# EasyEDA Pro project 红外ver2.0.eprj

# Schematic Schematic1

## Sheets
1 Source: Board Name: Board1; Create Date: 2025-09-16; Page Name: Source; Project Name: 红外ver2.0; Schematic Name: Schematic1; Update Date: 2025-09-17; Company: 嘉立创EDA; Drawed: lilinng; Page Size: A4; Version: V2.0
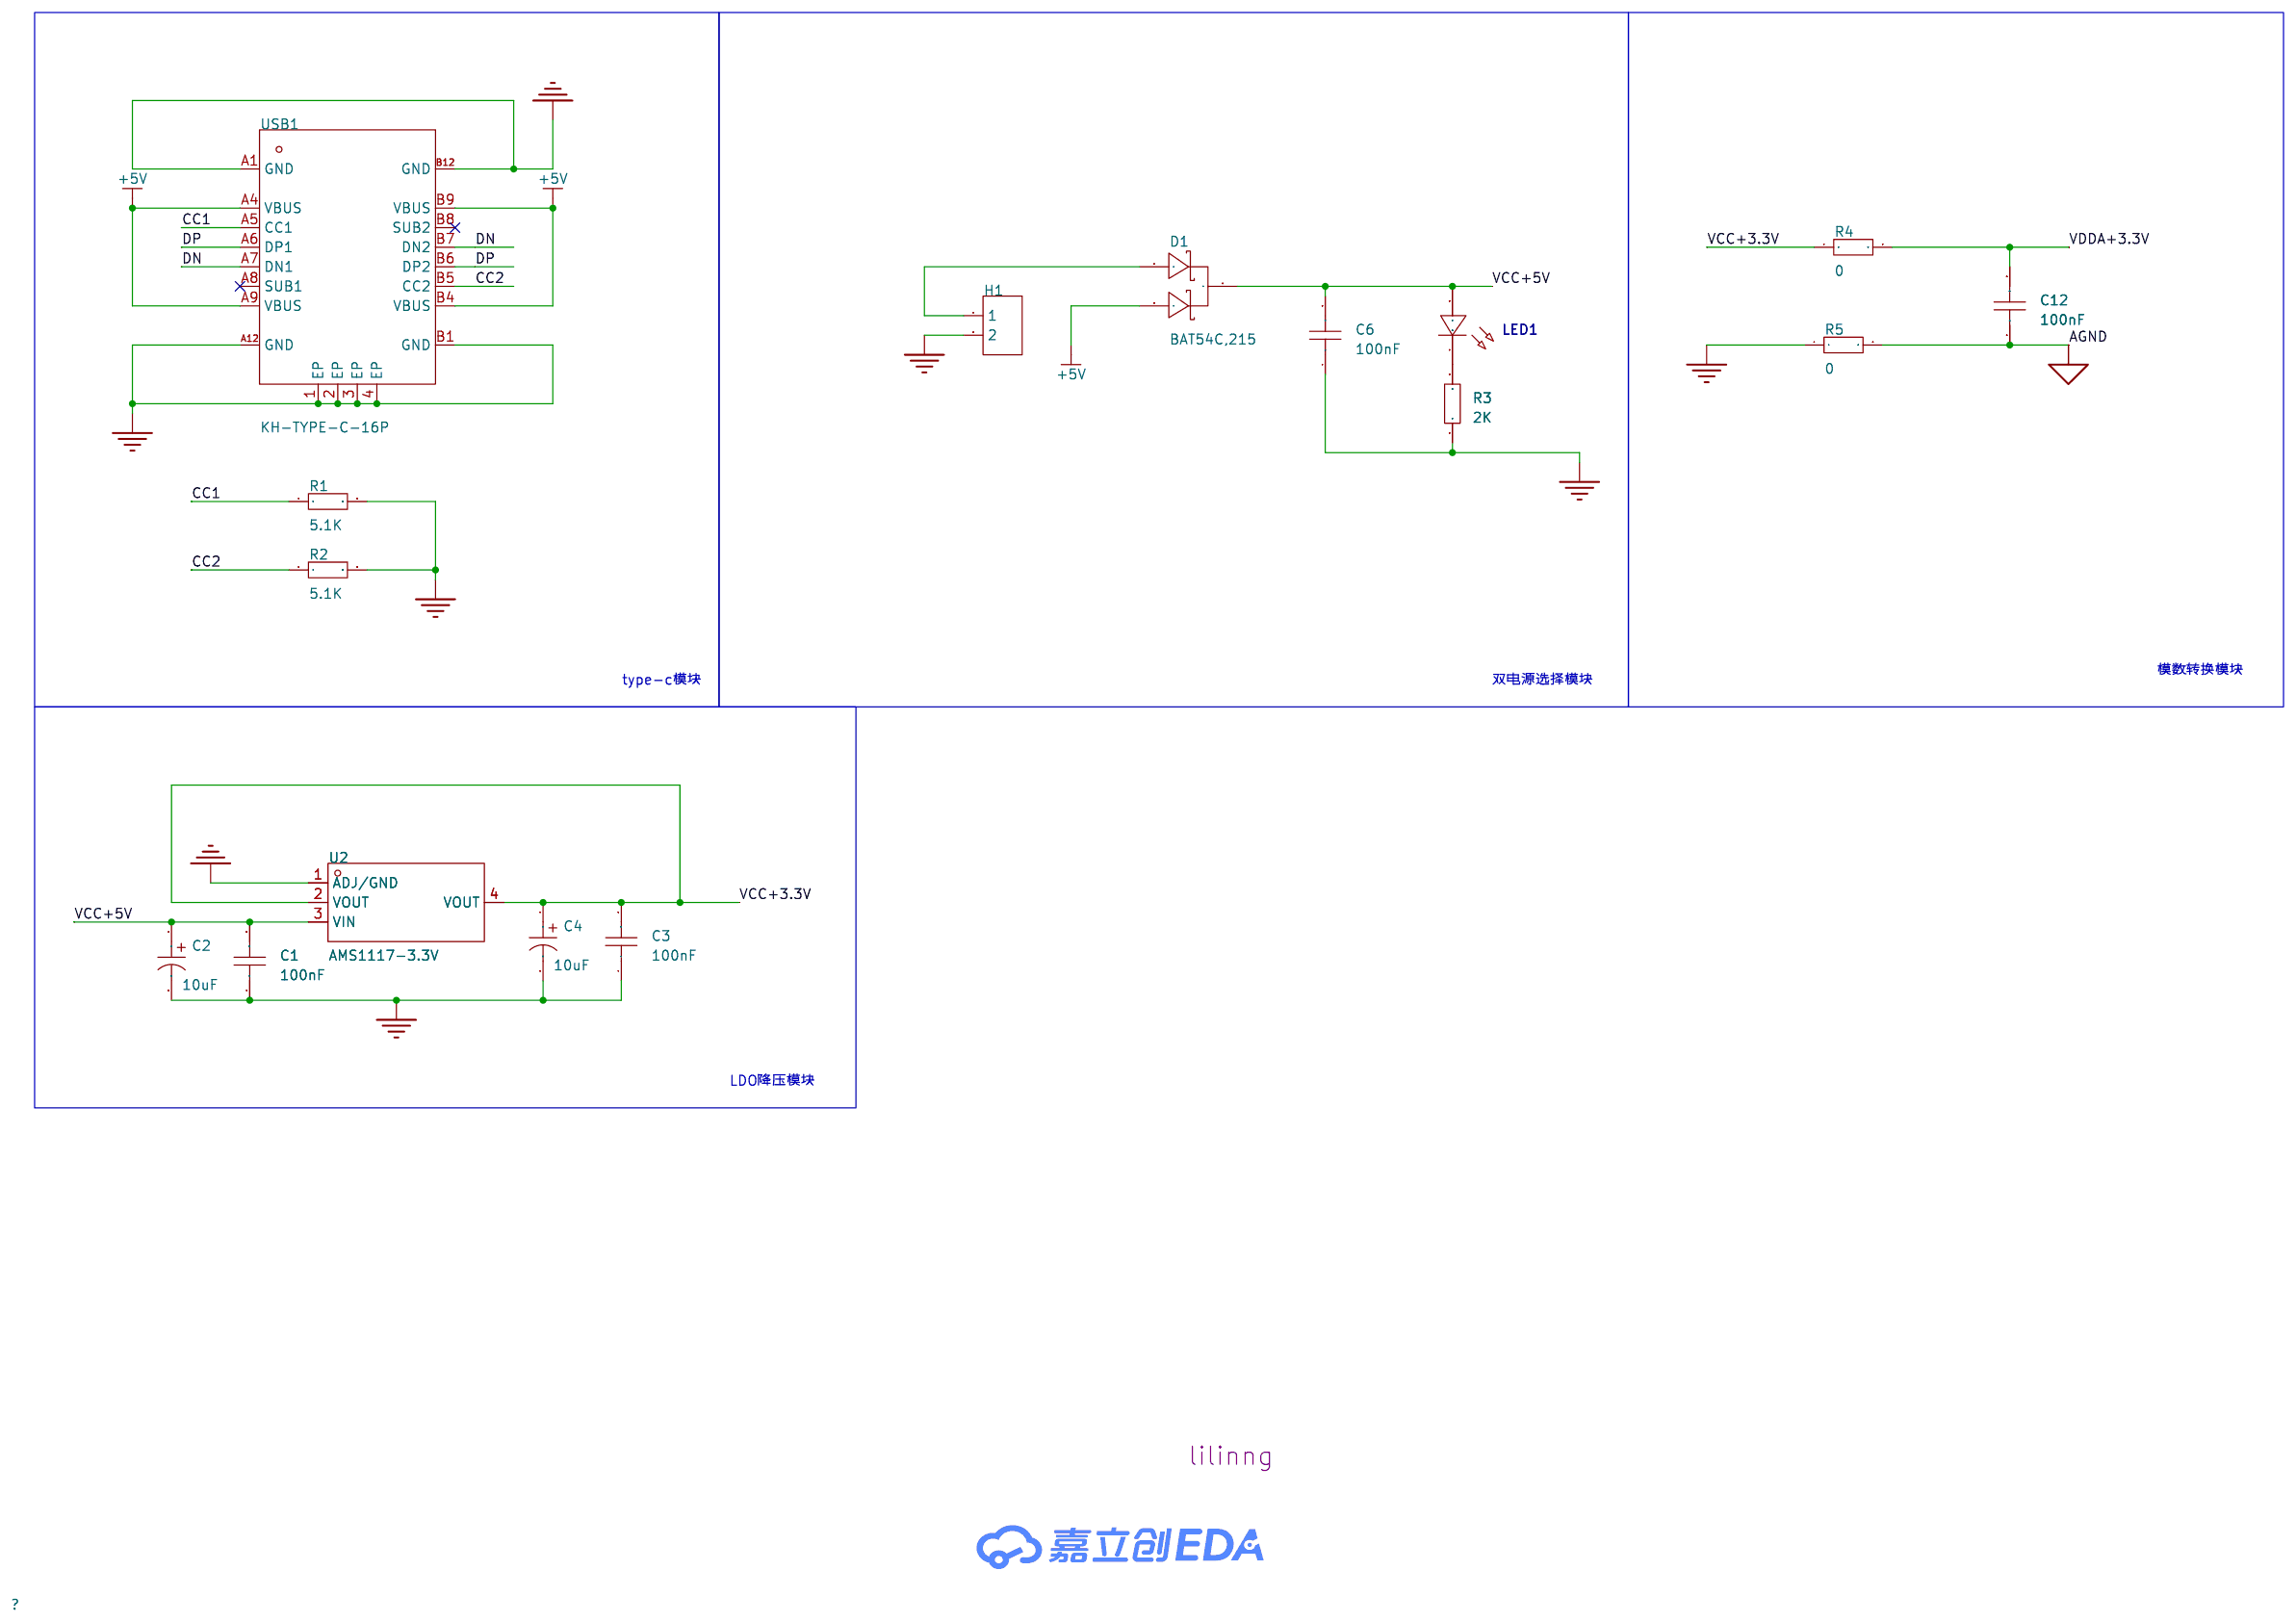
[diagram p0: Source]
2 System: Page Name: System; Version: V1.0
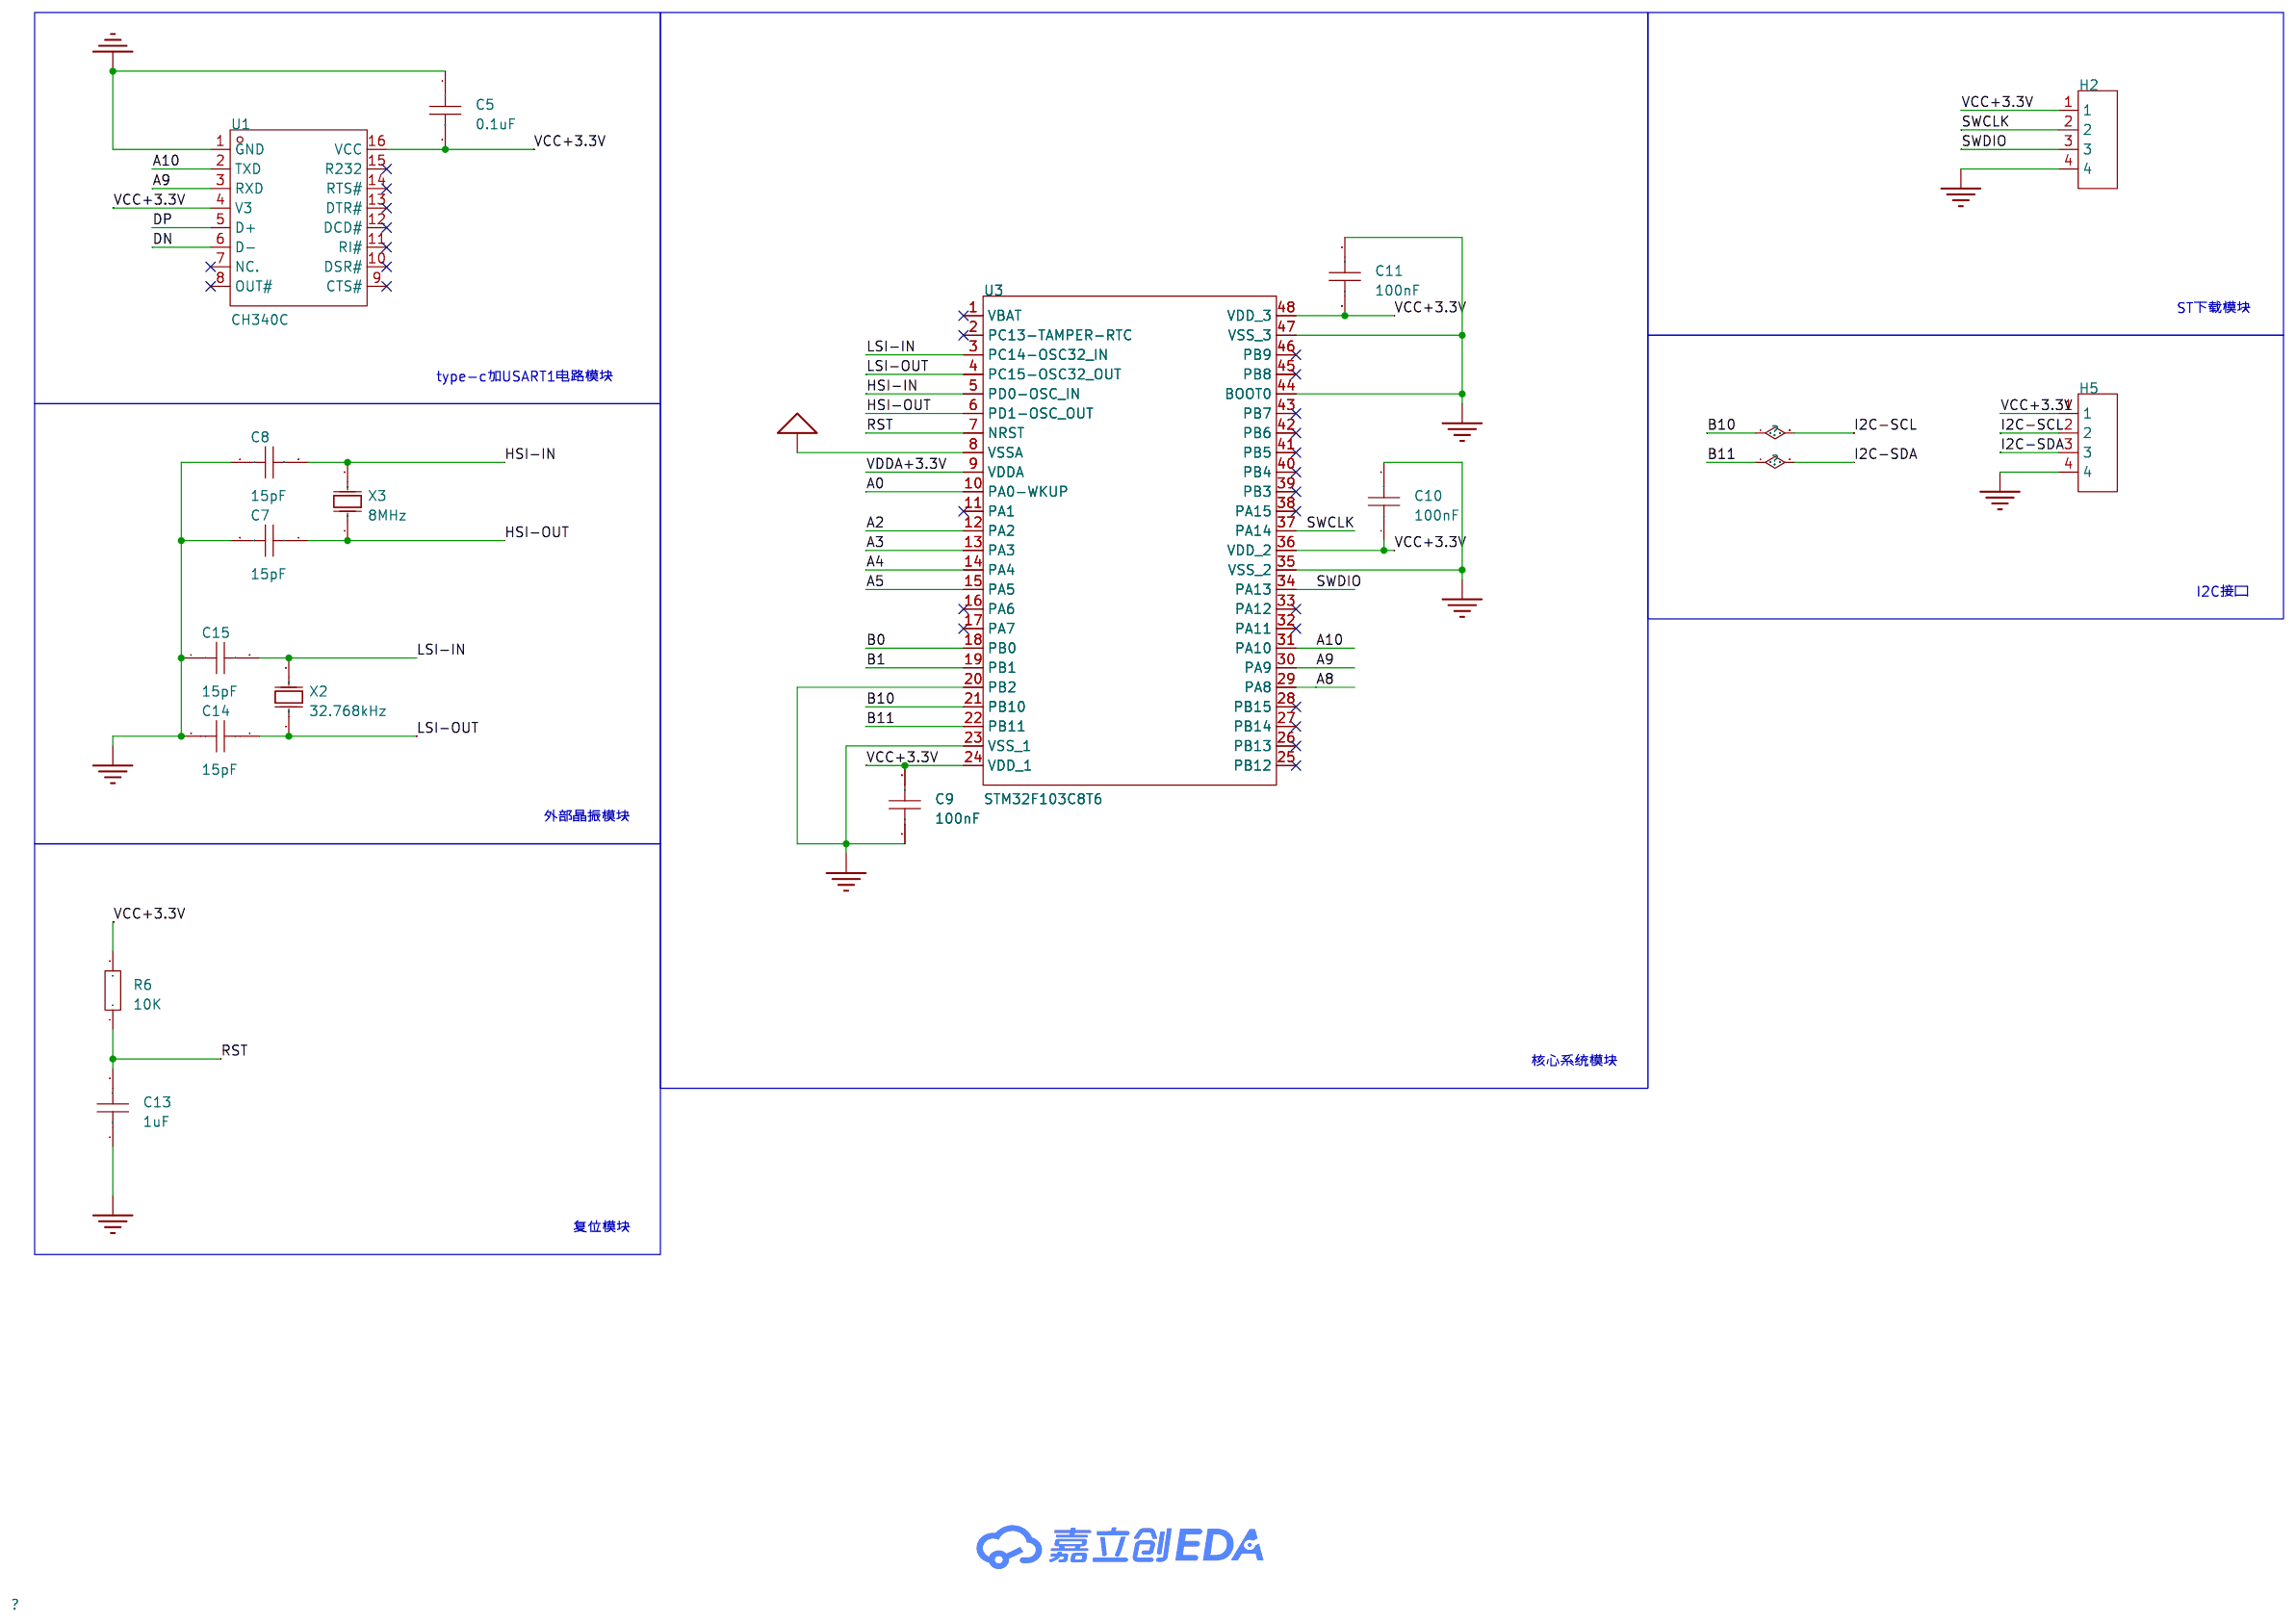
[diagram p1: System]
3 peripheral: Create Date: 2025-09-17; Page Name: peripheral; Update Date: 2025-09-19; Version: V1.0
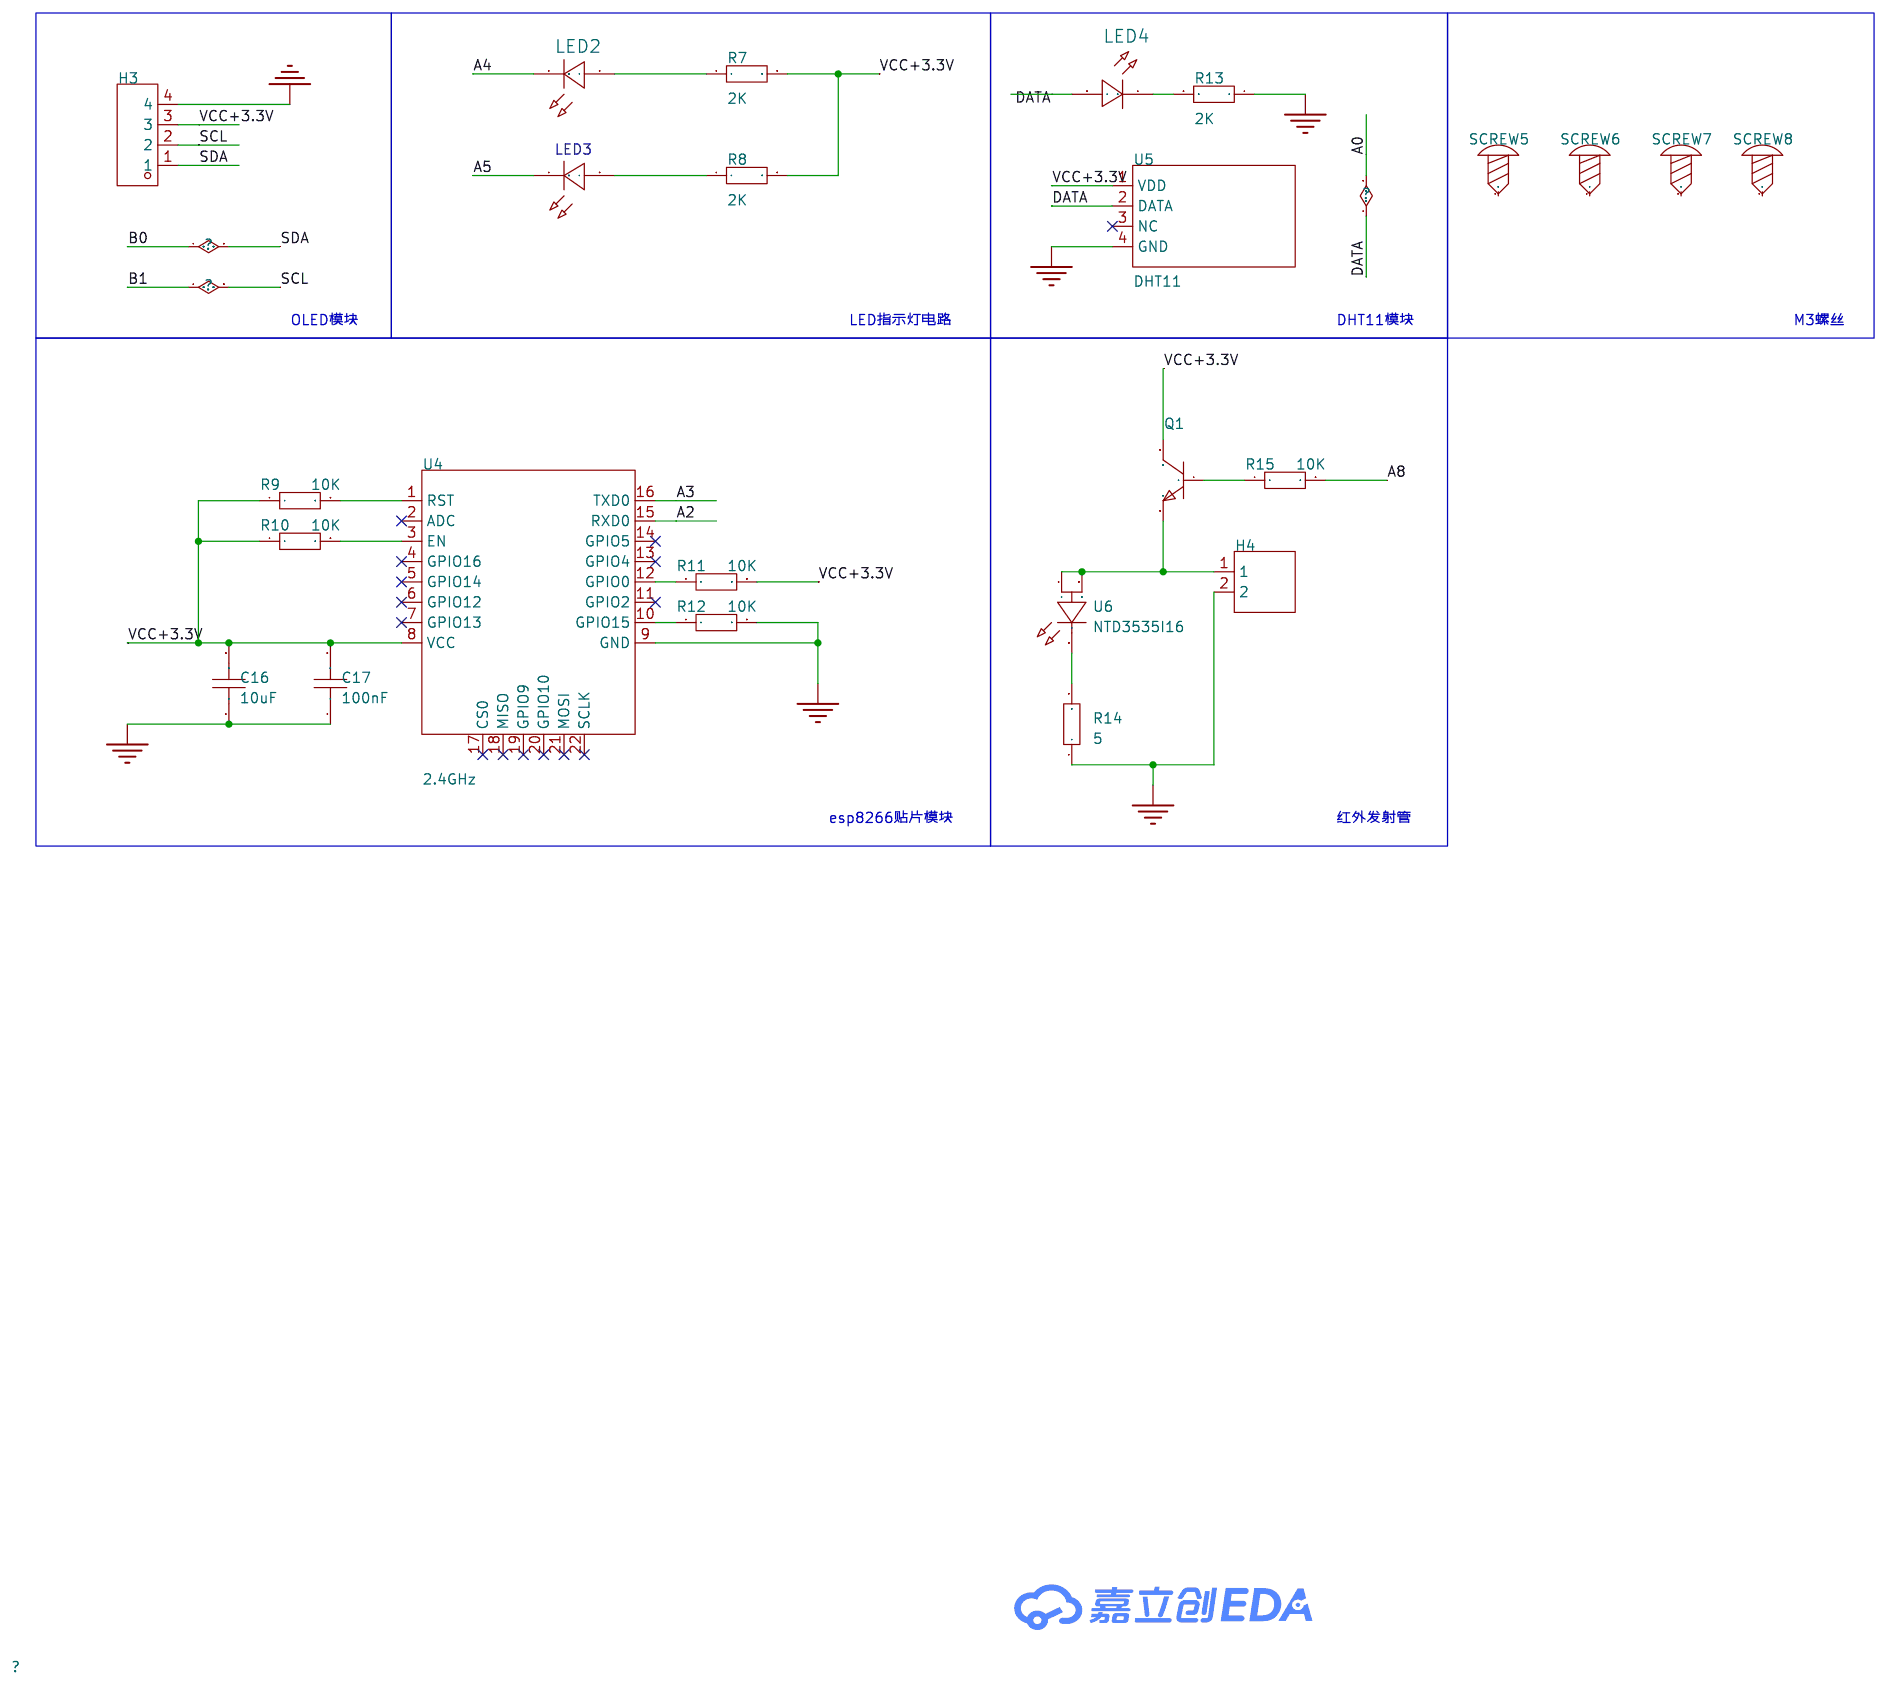
[diagram p2: peripheral]

## Parts
sheet peripheral
C16  10uF  [C0603]
C17  100nF  [C0603]
H3  -  [HDR-TH_4P-P2.54-V-F]
H4  -  [HDR-TH_2P-P2.54-V-M-1]
LED2  -  [LED_0603]
LED3  -  [LED_0603]
LED4  -  [LED_0603]
Q1  -  [S8050_SOT-23]
R7  2K  [R0603]
R8  2K  [R0603]
R9  10K  [R0805]
R10  10K  [R0805]
R11  10K  [R0805]
R12  10K  [R0805]
R13  2K  [R0805]
R14  5  [R0805]
R15  10K  [R0805]
SCREW5  -  [M3螺丝]
SCREW6  -  [M3螺丝]
SCREW7  -  [M3螺丝]
SCREW8  -  [M3螺丝]
U4  2.4GHz  [WIFIM-SMD_ESP-12F-ESP8266MOD]
U5  DHT11  [SENSOR-TH_DHT11]
U6  NTD3535I16  [LED-SMD_3P-L3.5-W3.5-NTD3535I16]
sheet Source
C1  100nF  [C0603]
C2  10uF  [CAP-SMD_BD5.0-L5.3-W5.3-LS6.0-FD]
C3  100nF  [C0603]
C4  10uF  [CAP-SMD_BD5.0-L5.3-W5.3-LS6.0-FD]
C6  100nF  [C0603]
C12  100nF  [C0603]
D1  BAT54C,215  [SOT-23-3_L2.9-W1.6-P1.90-LS2.8-BR]
H1  -  [HDR-TH_2P-P2.54-V-F]
LED1  -  [LED_0603]
R1  5.1K  [R0805]
R2  5.1K  [R0805]
R3  2K  [R0805]
R4  0  [R0805]
R5  0  [R0805]
U2  AMS1117-3.3V  [SOT-223-4_L6.5-W3.5-P2.30-LS7.0-TR]
USB1  KH-TYPE-C-16P  [USB-C-SMD_KH-TYPE-C-16P]
sheet System
C5  0.1uF  [C0603]
C7  15pF  [C0603]
C8  15pF  [C0603]
C9  100nF  [C0603]
C10  100nF  [C0603]
C11  100nF  [C0603]
C13  1uF  [C0603]
C14  15pF  [C0603]
C15  15pF  [C0603]
H2  -  [HDR-TH_4P-P2.54-V-M]
H5  -  [HDR-TH_4P-P2.54-V-M]
R6  10K  [R0805]
U1  CH340C  [SOP-16_L10.0-W3.9-P1.27-LS6.0-BL]
U3  STM32F103C8T6  [LQFP-48_L7.0-W7.0-P0.50-LS9.0-BL]
X2  32.768kHz  [CRYSTAL-SMD_L3.2-W1.5-1]
X3  8MHz  [CRYSTAL-SMD_L5.0-W3.2]

## Library data of the parts
C1 C3 C5-C17 = CAP_0603: Supplier Footprint: 0603
H3 = HDR-F_2.54_1x4P: Supplier Part: C2718488; Supplier Footprint: 插件
H4 = HDR-M_2.54_1x2P: Supplier Part: C124375; Supplier Footprint: 插件
LED2 LED4 = LED_0603-R: Supplier Footprint: 0603
LED3 = LED_0603-B: Supplier Footprint: 0603
Q1 = S8050_SOT_NPN: Supplier Footprint: SOT-23
R7 R8 = Res_0603: Supplier Footprint: 0603
R1-R6 R9-R15 = Res_0805: Supplier Footprint: 0805
SCREW5-SCREW8 = M3螺丝: Supplier Footprint: 插件
U4 = ESP-12F(ESP8266MOD): LCSC Part Name: 完整的802.11b/g/nWi-FiSoC模块 屏蔽罩上的丝印是：ESP8266MOD，ESP8266EX串口WIFI; Supplier Part: C82891; Manufacturer: Ai-Thinker(安信可); Supplier Footprint: SMD,16x24mm; JLCPCB Part Class: 扩展库; Datasheet: https://atta.szlcsc.com/upload/public/pdf/source/20210219/C82891_ABD84A460F4F056A2757267CCCA4B508.pdf; Supplier: LCSC; Core Processor: ESP8266芯片; Support Interface: GPIO；UART；I2C；PWM；SPI；ADC; Antenna Type: 板载PCB天线; Output Power: 16dBm; Operating Voltage: 3.3V; Receive  Current: 120mA; Send  Current: 170mA; Sensitivity: -90dBm; Operating Temperature: -40℃~+85℃
U5 = DHT11: LCSC Part Name: 新款电容式数字温湿度传感器,老款已停产16.1x12.6x5.8mm DHT11  电容式传感器; Supplier Part: C117051; Manufacturer: 广州奥松; Supplier Footprint: SIP-4; JLCPCB Part Class: 扩展库; Datasheet: https://atta.szlcsc.com/upload/public/pdf/source/20170703/1499081238365.pdf; Supplier: LCSC
U6 = NTD3535I16: LCSC Part Name: 红外灯 球头; Supplier Part: C7464756; Manufacturer: 国星光电; Supplier Footprint: SMD3535-3P; JLCPCB Part Class: 扩展库; Datasheet: https://item.szlcsc.com/datasheet/NTD3535I16/8503471.html; Supplier: LCSC; Voltage - Forward(Vf): 1.4V~2V; Pd - Power Dissipation: 110mW; Wavelength: 925nm~955nm; Radiant Intensity: 65mW/sr; Current - DC Forward(If): 350mA; Operating Temperature: -40℃~+100℃
C2 C4 = JVJ50v10M5x5: LCSC Part Name: 10uF ±20% 50V; Supplier Part: C46550416; Manufacturer: JIERR(捷而瑞); Supplier Footprint: SMD,D5xL5.4mm; JLCPCB Part Class: 扩展库; Datasheet: https://item.szlcsc.com/datasheet/JVJ50v10M5x5/48680110.html; Supplier: LCSC; Tolerance: ±20%; Voltage Rating: 50V; Ripple Current: 18mA@120Hz; Diameter: 5mm; Height - Seated (Max): 5.4mm; Lifetime: 2000hrs@105℃; Operating Temperature: -55℃~+105℃
D1 = BAT54C,215: LCSC Part Name: 电压:30V 电流:200mA; Supplier Part: C37704; Manufacturer: Nexperia(安世); Supplier Footprint: SOT-23; JLCPCB Part Class: 扩展库; Datasheet: https://item.szlcsc.com/datasheet/BAT54C%252C215/38684.html; Supplier: LCSC; Diode Configuration: 1对共阴极; Voltage - Forward(Vf@If): 800mV@100mA; Voltage - DC Reverse(Vr): 30V; Current - Rectified: 200mA; Reverse Leakage Current (Ir): 2uA@25V; Non-Repetitive Peak Forward Surge Current: 600mA
H1 = HDR-F_2.54_1x2P: Supplier Part: C49661; Supplier Footprint: 插件
LED1 = LED_0603-G: Supplier Footprint: 0603
U2 = AMS1117-3.3V: LCSC Part Name: 输入18V 输出3.3V 1A; Supplier Part: C5120765; Manufacturer: MSKSEMI(美森科); Supplier Footprint: SOT-223; JLCPCB Part Class: 扩展库; Datasheet: https://item.szlcsc.com/datasheet/AMS1117-3.3V/5706124.html; Supplier: LCSC; Output Type: 固定; Voltage - Supply: 12V; Output Voltage: 3.3V; Output Current: 1A; Voltage Dropout: 1.4V@(1A); standby current: 12mA; Features: 过流保护；过热保护; Operating Temperature: 0℃~+125℃@(Ta); Output Configuration: 正极; Number of Outputs: 1
USB1 = KH-TYPE-C-16P: LCSC Part Name: Type-C 母 卧贴; Supplier Part: C709357; Manufacturer: kinghelm(金航标); Supplier Footprint: SMD; JLCPCB Part Class: 扩展库; Datasheet: https://atta.szlcsc.com/upload/public/pdf/source/20200911/C709357_AA8DCEB38BB20E3035A7ED7AE7667837.pdf; Supplier: LCSC; Connector Type: Type-C; Gender: 母; Number of Ports: 1; Number of Contacts: 16P; Mounting Style: 卧贴; Current Rating - Power (Max): 3A; Operating Temperature Range: -40℃~+85℃
H2 H5 = HDR-M_2.54_1x4P: Supplier Part: C492403; Supplier Footprint: 插件
U1 = CH340C: Supplier Part: C84681; Manufacturer: WCH(南京沁恒); Supplier Footprint: SOP-16; JLCPCB Part Class: 扩展库; Datasheet: https://item.szlcsc.com/datasheet/CH340C/85852.html; Supplier: LCSC; Applications Function: 收发器; USB Protocol: USB 2.0; Voltage - Supply: 3.3V；5V; Data Rate: 2Mbps; Operating Temperature: -20℃~+70℃; Current - Supply: 7mA; Supply Current (Iq): 50uA
U3 = STM32F103C8T6: LCSC Part Name: 主流增强型ARM Cortex-M3 MCU，具有64 KB Flash、72 MHz CPU、电机控制、USB和CAN; Supplier Part: C8734; Manufacturer: ST(意法半导体); Supplier Footprint: LQFP-48(7x7); JLCPCB Part Class: 扩展库; Datasheet: https://item.szlcsc.com/datasheet/STM32F103C8T6/9243.html; Supplier: LCSC; CPU Core: ARM-M3; CPU Maximum Speed: 72MHz; Program Storage Size: 64KB; Program Memory Type: FLASH; Number of I/O: 37; ADC (Bit): 12bit; Voltage - Supply: 2V~3.6V
X2 = XKXGI-SUA-32.768K: LCSC Part Name: YST310S 32.768KHZ 2P 3215 12.5PF ±20PPM -40~85℃; Supplier Part: C5213671; Manufacturer: YXC(扬兴晶振); Supplier Footprint: SMD3215-2P; JLCPCB Part Class: 扩展库; Datasheet: https://item.szlcsc.com/datasheet/XKXGI-SUA-32.768K/5908943.html; Supplier: LCSC; Type: 贴片晶振; Normal temperature Frequency Tolerance: ±20ppm; Load Capacitance: 12.5pF; Frequency Stability: ±30ppm; Operating Temperature: -40℃~+85℃
X3 = X50328MSB2GI: LCSC Part Name: YSX530GA 8MHZ 2P 5032 20PF ±10PPM -40~85℃ (±20PPM); Supplier Part: C115962; Manufacturer: YXC(扬兴晶振); Supplier Footprint: SMD5032-2P; JLCPCB Part Class: 基础库; Datasheet: https://item.szlcsc.com/datasheet/X50328MSB2GI/117214.html; Supplier: LCSC; Type: 贴片晶振; Normal temperature Frequency Tolerance: ±10ppm; Load Capacitance: 20pF; Frequency Stability: ±20ppm; Operating Temperature: -40℃~+85℃

## Nets
+5V: D1.2(A) USB1.A4(VBUS) USB1.A9(VBUS) USB1.B4(VBUS) USB1.B9(VBUS)
AGND: C12.1 R5.2 U3.8(VSSA)
GND: C1.1 C2.2 C3.1 C4.2 C5.1 C6.1 C7.2 C8.1 C9.1 C10.2 C11.1 C13.1 C14.2 C15.1 C16.1 C17.1 H1.2 H2.4 H3.4 H4.2 H5.4 R1.2 R2.2 R3.1 R5.1 R12.2 R13.1 R14.1 U1.1(GND) U2.1(ADJ/GND) U3.20(PB2) U3.23(VSS_1) U3.35(VSS_2) U3.44(BOOT0) U3.47(VSS_3) U4.9(GND) U5.4(GND) USB1.1(EP) USB1.2(EP) USB1.3(EP) USB1.4(EP) USB1.A1(GND) USB1.A12(GND) USB1.B1(GND) USB1.B12(GND)
VCC+3.3V: C3.2 C4.1 C5.2 C9.2 C10.1 C11.2 C16.2 C17.2 H2.1 H3.3 H5.1 Q1.3 R4.1 R6.2 R7.2 R8.2 R9.1 R10.1 R11.2 U1.4(V3) U1.16(VCC) U2.2(VOUT) U2.4(VOUT) U3.24(VDD_1) U3.36(VDD_2) U3.48(VDD_3) U4.8(VCC) U5.1(VDD)
VCC+5V: C1.2 C2.1 C6.2 D1.3(K) LED1.2(A) U2.3(VIN)
VDDA+3.3V: C12.2 R4.2 U3.9(VDDA)
A0: LED4.2(A) U3.10(PA0-WKUP) U5.2(DATA)
A2: U3.12(PA2) U4.15(RXD0)
A3: U3.13(PA3) U4.16(TXD0)
A4: LED2.1(C) U3.14(PA4)
A5: LED3.1(C) U3.15(PA5)
A8: R15.2 U3.29(PA8)
A9: U1.3(RXD) U3.30(PA9)
A10: U1.2(TXD) U3.31(PA10)
B0: H3.1 U3.18(PB0)
B1: H3.2 U3.19(PB1)
B10: H5.2 U3.21(PB10)
B11: H5.3 U3.22(PB11)
CC1: R1.1 USB1.A5(CC1)
CC2: R2.1 USB1.B5(CC2)
DN: U1.6(D-) USB1.A7(DN1) USB1.B7(DN2)
DP: U1.5(D+) USB1.A6(DP1) USB1.B6(DP2)
HSI-IN: C8.2 U3.5(PD0-OSC_IN) X3.2(OSC2)
HSI-OUT: C7.1 U3.6(PD1-OSC_OUT) X3.1(OSC1)
LSI-IN: C15.2 U3.3(PC14-OSC32_IN) X2.2(OSC2)
LSI-OUT: C14.1 U3.4(PC15-OSC32_OUT) X2.1(OSC1)
RST: C13.2 R6.1 U3.7(NRST)
SWCLK: H2.2 U3.37(PA14)
SWDIO: H2.3 U3.34(PA13)
$1N3764: LED1.1(C) R3.2
$1N4521: D1.1(A) H1.1
$3N420: LED2.2(A) R7.1
$3N525: LED3.2(A) R8.1
$3N833: R9.2 U4.1(RST)
$3N837: R10.2 U4.3(EN)
$3N1055: R11.1 U4.12(GPIO0)
$3N1059: R12.1 U4.10(GPIO15)
$3N1324: LED4.1(C) R13.2
$3N1566: R14.2 U6.3(K)
$3N1643: Q1.1 R15.1
$3N3384: H4.1 Q1.2 U6.1(A) U6.2

Not connected (* = marked no-connect by the designer): SCREW5 1; SCREW6 1; SCREW7 1; SCREW8 1; U1 7(NC.)* 8(OUT#)* 9(CTS#)* 10(DSR#)* 11(RI#)* 12(DCD#)* 13(DTR#)* 14(RTS#)* 15(R232)*; U3 1(VBAT)* 2(PC13-TAMPER-RTC)* 11(PA1)* 16(PA6)* 17(PA7)* 25(PB12)* 26(PB13)* 27(PB14)* 28(PB15)* 32(PA11)* 33(PA12)* 38(PA15)* 39(PB3)* 40(PB4)* 41(PB5)* 42(PB6)* 43(PB7)* 45(PB8)* 46(PB9)*; U4 2(ADC)* 4(GPIO16)* 5(GPIO14)* 6(GPIO12)* 7(GPIO13)* 11(GPIO2)* 13(GPIO4)* 14(GPIO5)* 17(CS0)* 18(MISO)* 19(GPIO9)* 20(GPIO10)* 21(MOSI)* 22(SCLK)*; U5 3(NC)*; USB1 A8(SUB1)* B8(SUB2)*

## Notes on the sheets
sheet 1
- type-c模块
- 双电源选择模块
- 模数转换模块
- LDO降压模块
sheet 2
- ST下载模块
- type-c加USART1电路模块
- I2C接口
- 外部晶振模块
- 核心系统模块
- 复位模块
sheet 3
- OLED模块
- LED指示灯电路
- DHT11模块
- M3螺丝
- esp8266贴片模块
- 红外发射管

# Board PCB1
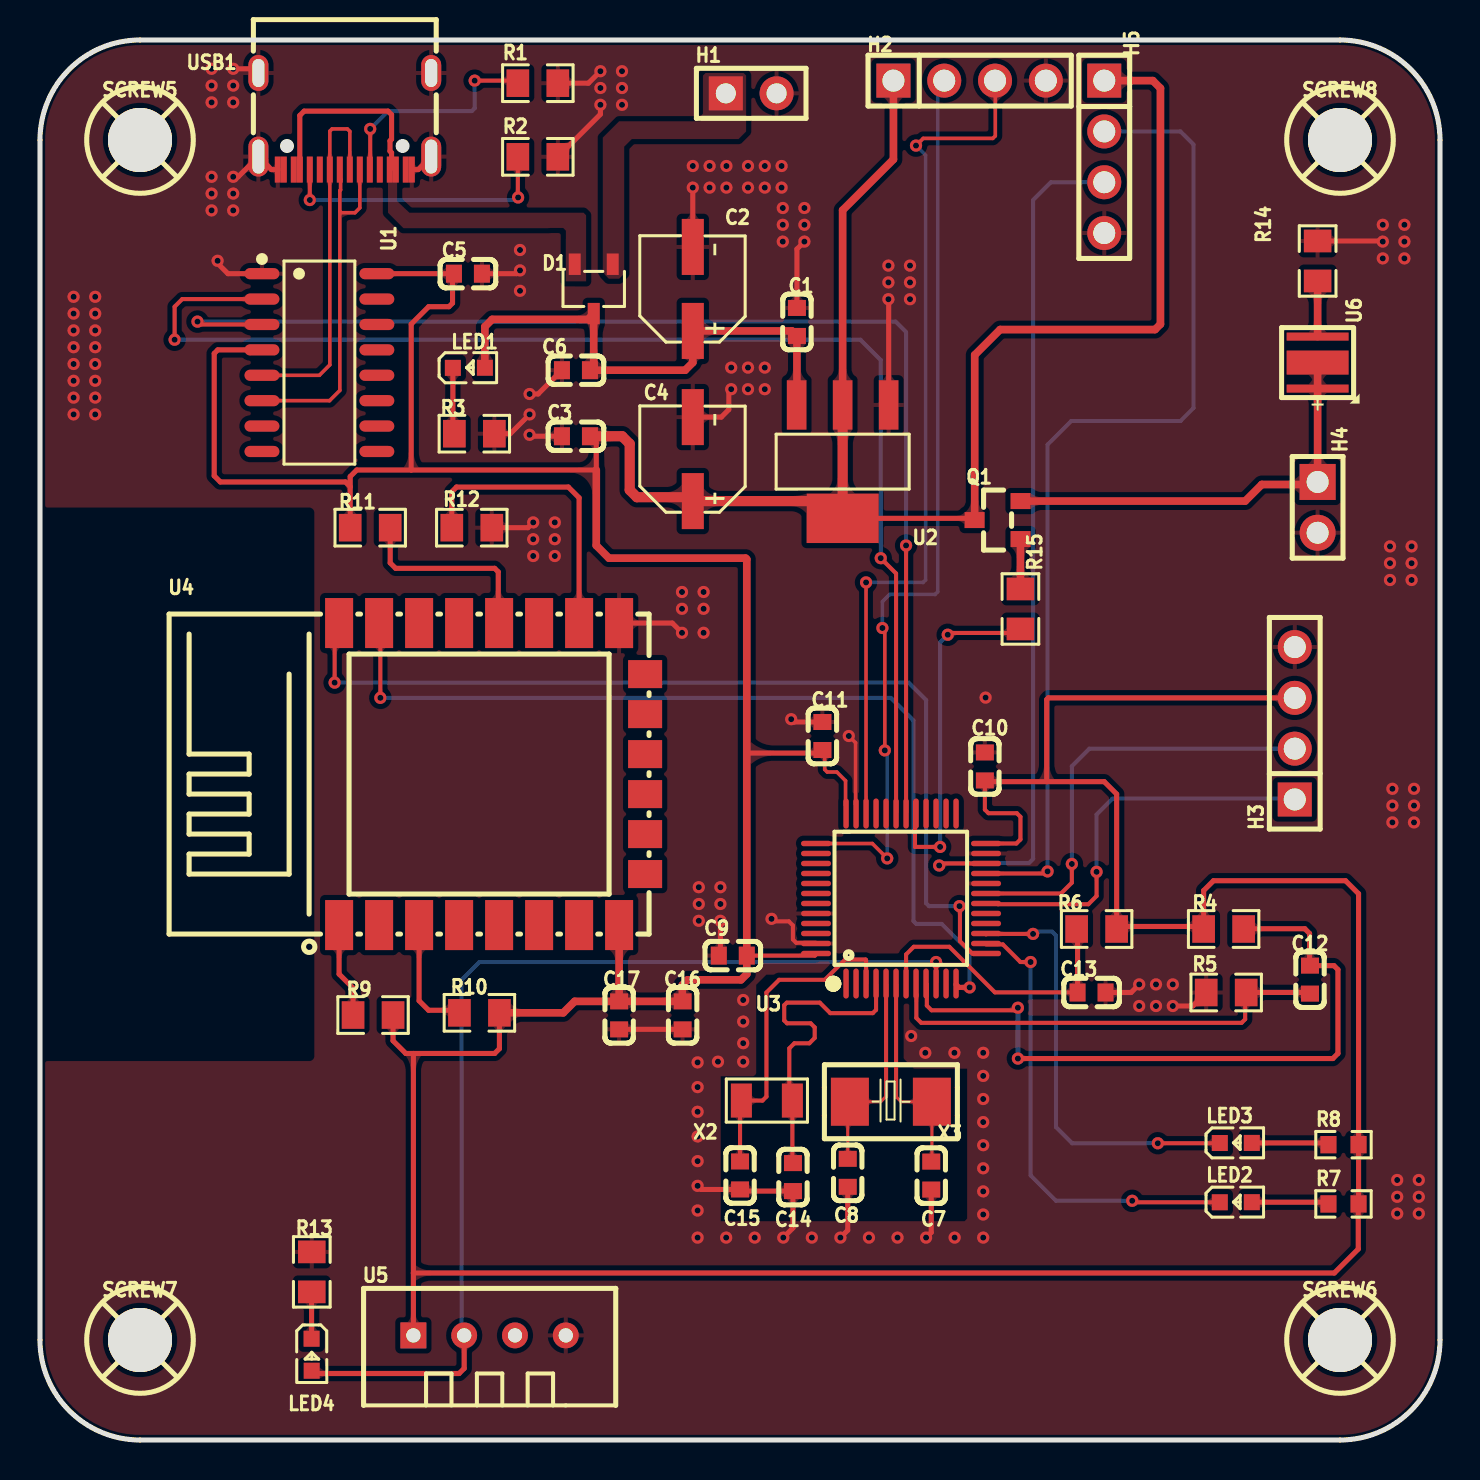
[diagram p3: board, top side]
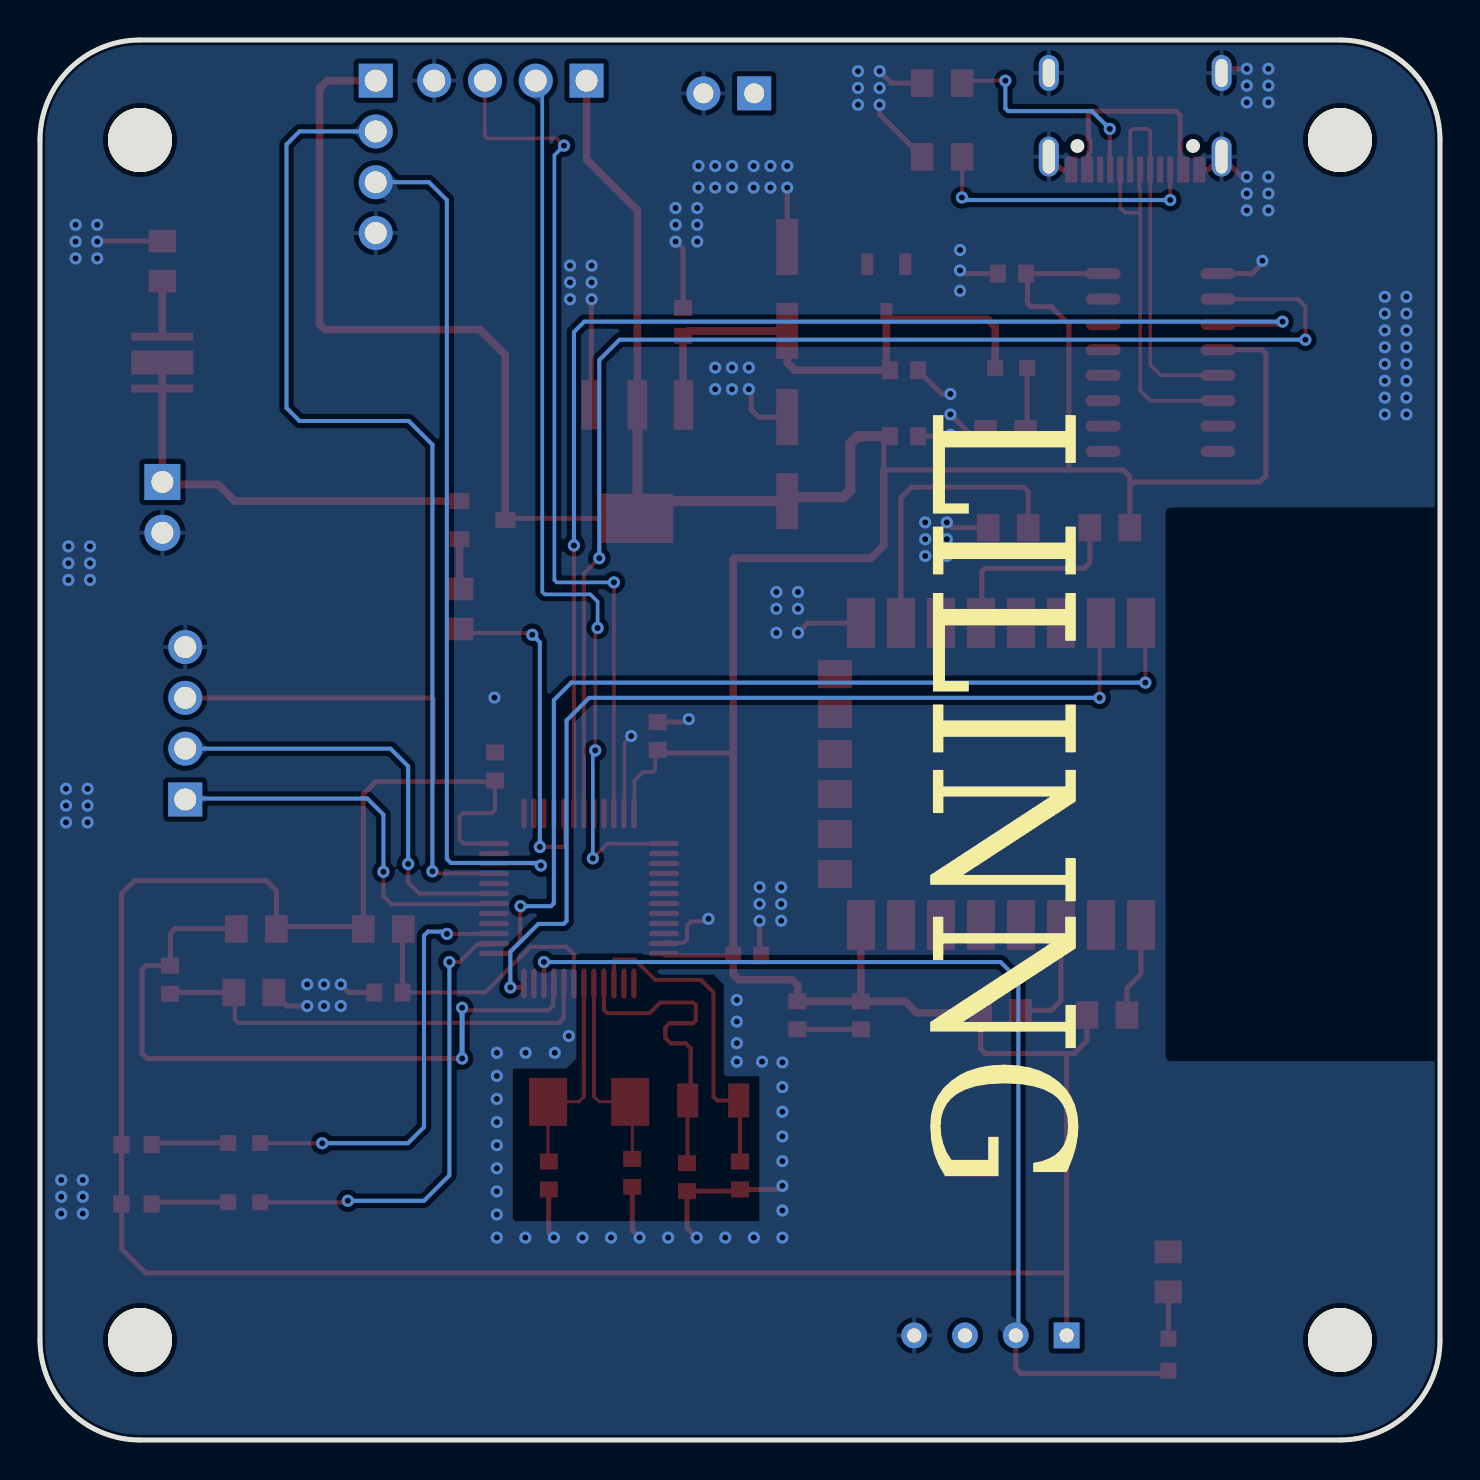
[diagram p4: board, bottom side, seen from below]

Outline 70 x 70 mm; copper layers: Top Layer, Bottom Layer. Coordinates in mm from the lower left corner of the outline.
Outline path: 0,65 0,5 arc(1.46,1.46) 5,0 65,0 arc(68.54,1.46) 70,5 70,65 arc(68.54,68.54) 65,70 5,70 arc(1.46,68.54) 0,65
Stack: Top Layer 0.035mm / Dielectric1 1.51mm FR4 er 4.5 / Bottom Layer 0.035mm

## Design rules (mm)
net HSI-OUT: DP2
net HSI-IN: DP2
net LSI-OUT: DP3
net LSI-IN: DP3
net DP: DP1
net DN: DP1
template: 自定义配置
spacing copperThickness1oz (default): track to track 0.102, other pairs 0 to 0.3
spacing copperThickness2oz: track to track 0.203, other pairs 0.152 to 0.3
track width copperThickness1oz (default): min 0.127, default 0.254, max 2.54
track width copperThickness2oz: min 0.203, default 0.254, max 2.54
differential pair differentialPair (default): width min 0.127, default 0.254, max 2.54; gap min 0.152, default 0.152
via viaSize (default): diameter min 0.5, default 0.61, max 10; hole min 0.3, default 0.305, max 6.3

## Placement (name value [footprint] x y rotation side)
C1  100nF  [C0603]  37.85 55.9 270 top
C2  10uF  [CAP-SMD_BD5.0-L5.3-W5.3-LS6.0-FD]  32.64 57.55 90 top
C3  100nF  [C0603]  26.8 50.19 0 top
C4  10uF  [CAP-SMD_BD5.0-L5.3-W5.3-LS6.0-FD]  32.64 49.05 90 top
C5  0.1uF  [C0603]  21.4 58.32 180 top
C6  100nF  [C0603]  26.8 53.49 0 top
C7  15pF  [C0603]  44.56 13.22 270 top
C8  15pF  [C0603]  40.39 13.36 90 top
C9  100nF  [C0603]  34.64 24.22 0 top
C10  100nF  [C0603]  47.24 33.68 90 top
C11  100nF  [C0603]  39.12 35.2 270 top
C12  100nF  [C0603]  63.5 23.02 90 top
C13  1uF  [C0603]  52.58 22.38 180 top
C14  15pF  [C0603]  37.65 13.15 270 top
C15  15pF  [C0603]  35 13.23 90 top
C16  10uF  [C0603]  32.13 21.23 90 top
C17  100nF  [C0603]  28.96 21.23 90 top
D1  BAT54C,215  [SOT-23-3_L2.9-W1.6-P1.90-LS2.8-BR]  27.69 57.55 90 top
H1  -  [HDR-TH_2P-P2.54-V-F]  35.56 67.33 0 top
H2  -  [HDR-TH_4P-P2.54-V-M]  46.48 67.97 0 top
H3  -  [HDR-TH_4P-P2.54-V-F]  62.74 35.84 90 top
H4  -  [HDR-TH_2P-P2.54-V-M-1]  63.88 46.63 270 top
H5  -  [HDR-TH_4P-P2.54-V-M]  53.21 64.16 270 top
LED1  -  [LED_0603]  21.49 53.62 0 top
LED2  -  [LED_0603]  59.84 11.9 0 top
LED3  -  [LED_0603]  59.84 14.86 0 top
LED4  -  [LED_0603]  13.59 4.21 270 top
Q1  -  [S8050_SOT-23]  47.88 45.87 0 top
R1  5.1K  [R0805]  24.89 67.84 0 top
R2  5.1K  [R0805]  24.89 64.16 0 top
R3  2K  [R0805]  21.72 50.31 180 top
R4  0  [R0805]  59.18 25.55 0 top
R5  0  [R0805]  59.31 22.38 0 top
R6  10K  [R0805]  52.83 25.55 0 top
R7  2K  [R0603]  65.17 11.8 0 top
R8  2K  [R0603]  65.17 14.77 0 top
R9  10K  [R0805]  16.65 21.25 180 top
R10  10K  [R0805]  21.97 21.36 180 top
R11  10K  [R0805]  16.51 45.62 180 top
R12  10K  [R0805]  21.59 45.62 0 top
R13  2K  [R0805]  13.59 8.41 270 top
R14  5  [R0805]  63.88 58.95 270 top
R15  10K  [R0805]  49.02 41.55 270 top
SCREW5  -  [M3螺丝]  5 65 0 top
SCREW6  -  [M3螺丝]  65 5 0 top
SCREW7  -  [M3螺丝]  5 5 0 top
SCREW8  -  [M3螺丝]  65 65 0 top
U1  CH340C  [SOP-16_L10.0-W3.9-P1.27-LS6.0-BL]  13.97 53.87 270 top
U2  AMS1117-3.3V  [SOT-223-4_L6.5-W3.5-P2.30-LS7.0-TR]  40.13 48.92 180 top
U3  STM32F103C8T6  [LQFP-48_L7.0-W7.0-P0.50-LS9.0-BL]  43.05 27.07 0 top
U4  2.4GHz  [WIFIM-SMD_ESP-12F-ESP8266MOD]  22.61 33.3 0 top
U5  DHT11  [SENSOR-TH_DHT11]  22.48 5.23 0 top
U6  NTD3535I16  [LED-SMD_3P-L3.5-W3.5-NTD3535I16]  63.88 53.87 270 top
USB1  KH-TYPE-C-16P  [USB-C-SMD_KH-TYPE-C-16P]  15.24 65.94 180 top
X2  32.768kHz  [CRYSTAL-SMD_L3.2-W1.5-1]  36.34 16.97 180 top
X3  8MHz  [CRYSTAL-SMD_L5.0-W3.2]  42.54 16.91 180 top

## Footprints (pads in the part's own frame, mm; a bottom-side part is the same pattern mirrored in y, then rotated)
C0603
  rect 0.8x0.9 smd: 1(-0.7,0) 2(0.7,0)
CAP-SMD_BD5.0-L5.3-W5.3-LS6.0-FD
  rect 2.8x1.1 smd: 1(-2.1,0) 2(2.1,0)
CRYSTAL-SMD_L3.2-W1.5-1
  rect 1.05x1.7 smd: 1(-1.275,0) 2(1.275,0)
CRYSTAL-SMD_L5.0-W3.2
  rect 1.9x2.4 smd: 1(-2.05,0) 2(2.05,0)
HDR-TH_2P-P2.54-V-F
  rect 1.7x1.7 hole 1: 1(-1.27,0)
  round 1.7 hole 1: 2(1.27,0)
HDR-TH_2P-P2.54-V-M-1
  rect 1.8x1.8 hole 1.1: 1(-1.27,0)
  round 1.8 hole 1.1: 2(1.27,0)
HDR-TH_4P-P2.54-V-F
  rect 1.7x1.7 hole 1.1: 1(-3.81,0)
  round 1.7 hole 1.1: 2(-1.27,0) 3(1.27,0) 4(3.81,0)
HDR-TH_4P-P2.54-V-M
  rect 1.7x1.7 hole 1.1: 1(-3.81,0)
  round 1.7 hole 1.1: 2(-1.27,0) 3(1.27,0) 4(3.81,0)
LED-SMD_3P-L3.5-W3.5-NTD3535I16
  rect 0.4x3.1 smd: 1(1.3,0) 3(-1.3,0)
  rect 1.2x3.1 smd: 2(0,0)
LED_0603
  rect 0.8x0.8 smd: 1(-0.851,-0.01) 2(0.75,-0.005)
LQFP-48_L7.0-W7.0-P0.50-LS9.0-BL
  oval 0.27x1.5 smd: 1(-2.75,-4.25) 2(-2.25,-4.25) 3(-1.75,-4.25) 4(-1.25,-4.25) 5(-0.75,-4.25) 6(-0.25,-4.25) 7(0.25,-4.25) 8(0.75,-4.25) 9(1.25,-4.25) 10(1.75,-4.25) 11(2.25,-4.25) 12(2.75,-4.25) 25(2.75,4.25) 26(2.25,4.25) 27(1.75,4.25) 28(1.25,4.25) 29(0.75,4.25) 30(0.25,4.25) 31(-0.25,4.25) 32(-0.75,4.25) 33(-1.25,4.25) 34(-1.75,4.25) 35(-2.25,4.25) 36(-2.75,4.25)
  oval 1.5x0.27 smd: 13(4.25,-2.75) 14(4.25,-2.25) 15(4.25,-1.75) 16(4.25,-1.25) 17(4.25,-0.75) 18(4.25,-0.25) 19(4.25,0.25) 20(4.25,0.75) 21(4.25,1.25) 22(4.25,1.75) 23(4.25,2.25) 24(4.25,2.75) 37(-4.25,2.75) 38(-4.25,2.25) 39(-4.25,1.75) 40(-4.25,1.25) 41(-4.25,0.75) 42(-4.25,0.25) 43(-4.25,-0.25) 44(-4.25,-0.75) 45(-4.25,-1.25) 46(-4.25,-1.75) 47(-4.25,-2.25) 48(-4.25,-2.75)
M3螺丝
  round 3.2 hole 3.2: 1(0,0)
R0603
  rect 0.806x0.864 smd: 1(-0.753,0) 2(0.753,0)
R0805
  rect 1.133x1.377 smd: 1(-1,0) 2(1,0)
S8050_SOT-23
  rect 1x0.8 smd: 1(1.15,-0.823) 2(1.15,1.077) 3(-1.15,0.127)
SENSOR-TH_DHT11
  rect 1.296x1.296 hole 0.711: 1(-3.81,0)
  round 1.296 hole 0.711: 2(-1.27,0) 3(1.27,0) 4(3.81,0)
SOP-16_L10.0-W3.9-P1.27-LS6.0-BL
  oval 0.56x1.745 smd: 1(-4.445,-2.873) 2(-3.175,-2.873) 3(-1.905,-2.873) 4(-0.635,-2.873) 5(0.635,-2.873) 6(1.905,-2.873) 7(3.175,-2.873) 8(4.445,-2.873) 9(4.445,2.873) 10(3.175,2.873) 11(1.905,2.873) 12(0.635,2.873) 13(-0.635,2.873) 14(-1.905,2.873) 15(-3.175,2.873) 16(-4.445,2.873)
SOT-23-3_L2.9-W1.6-P1.90-LS2.8-BR
  rect 1.07x0.6 smd: 1(1.235,-0.95) 2(1.235,0.95) 3(-1.235,0)
SOT-223-4_L6.5-W3.5-P2.30-LS7.0-TR
  rect 0.98x2.47 smd: 1(-2.3,-2.835) 2(0,-2.835) 3(2.3,-2.835)
  rect 3.6x2.47 smd: 4(0,2.835)
USB-C-SMD_KH-TYPE-C-16P
  oval 1x2 hole 0.6x1.7: 1(-4.32,1.765) 2(4.32,1.765)
  oval 1x1.8 hole 0.6x1.4: 3(-4.32,-2.415) 4(4.32,-2.415)
  rect 0.3x1.3 smd: A1(-3.35,2.415) A4(-2.55,2.415) A5(-1.25,2.415) A6(-0.25,2.415) A7(0.25,2.415) A8(1.25,2.415) A9(2.55,2.415) A12(3.35,2.415) B1(3.05,2.415) B4(2.25,2.415) B5(1.75,2.415) B6(0.75,2.415) B7(-0.75,2.415) B8(-1.75,2.415) B9(-2.25,2.415) B12(-3.05,2.415)
WIFIM-SMD_ESP-12F-ESP8266MOD
  rect 1.4x2.5 smd: 1(-7.651,-7.551) 2(-5.651,-7.551) 3(-3.651,-7.551) 4(-1.651,-7.551) 5(0.349,-7.551) 6(2.349,-7.551) 7(4.349,-7.551) 8(6.349,-7.551) 9(6.349,7.548) 10(4.349,7.55) 11(2.349,7.551) 12(0.349,7.551) 13(-1.651,7.55) 14(-3.651,7.551) 15(-5.651,7.551) 16(-7.651,7.551)
  rect 1.7x1.4 smd: 17(7.651,-5) 18(7.649,-3.002) 19(7.649,-1.004) 20(7.649,0.998) 21(7.649,2.997) 22(7.651,4.997)

## Nets
As in the schematic.

Pads without a net: SCREW5 1; SCREW6 1; SCREW7 1; SCREW8 1; U1 7 8 9 10 11 12 13 14 15; U3 1 2 11 16 17 25 26 27 28 32 33 38 39 40 41 42 43 45 46; U4 2 4 5 6 7 11 13 14 17 18 19 20 21 22; U5 3; USB1 A8 B8

## Via types
v1: diameter 0.61, hole 0.305, Top Layer to Bottom Layer, 187 vias

## Routing (per net, layer and track width the routed paths; a pad name or vN(x,y) marks a point on that pad's centre or on a via; arc(x,y) is an arc through that point)
+5V: length 10.3
  Top Layer w0.254: USB1.B9 17.58,63.61 17.58,64.36 17.5,64.44 17.5,64.96 17.58,65.04 17.58,66.26 17.4,66.44 13.21,66.44 12.99,66.23 USB1.B4
AGND: length 22.3
  Top Layer w0.203: 60.26,22.2 60.26,21.04 60.08,20.86 44.06,20.86 43.82,21.1 43.82,22.28
  Top Layer w0.254: 63.59,22.16 63.38,22.38 60.36,22.38
GND: length 75.3
  Top Layer w0.178: v1(40.44,35.2) 40.78,34.86 40.78,31.78 40.8,31.75 U3.35
  Top Layer w0.203: v1(36.58,26.06) 36.7,25.93 37.44,25.93 37.65,25.73 37.65,25.03 37.81,24.86 38.8,24.86
  Top Layer w0.254: R14.1 67.11,59.95 v1(67.14,59.92) ; v1(37.56,36.04) 37.7,35.9 C11.1 ; R3.1 23.52,50.31 v1(24.48,51.28) ; USB1.A1 18.91,63.52 USB1.1 ; v1(54.96,22.78) 54.56,22.38 C13.1 ; R1.2 27.42,67.84 v1(28.02,68.44) ; v1(32.1,40.36) 31.61,40.85 U4.9 ; v1(24.66,45.88) 24.4,45.62 R12.2 ; v1(40.02,10.12) 40.39,10.49 C8.1 ; v1(56.64,21.7) 57.63,21.7 R5.1 ; 33.94,24.22 34.02,24.3 v1(34.02,25.96) ; U2.1 42.43,57.03 v1(42.42,57.04) ; C3.1 24.55,50.19 v1(24.48,50.26) ; C5.1 23.84,58.32 v1(24,58.48) ; v1(9.66,68.56) 10.71,68.56 USB1.4 ; C6.1 24.91,52.3 v1(24.48,52.3) ; v1(28.02,66.76) 28.02,66.29 R2.2 ; C4.2 34.06,51.14 34.44,51.52 34.44,52.42 v1(34.56,52.54) ; C17.1 C16.1 ; C1.1 37.85,59.55 v1(38.22,59.92) ; C7.2 44.56,10.38 v1(44.3,10.12) ; 8.89,58.82 9.4,58.32 U1.1 ; C2.2 32.64,62.62 ; v1(37.16,10.12) 37.65,10.6 C14.2 35.08,12.45 C15.1 33.06,12.53 v1(32.88,12.71) ; v1(9.66,63.16) 9.91,63.16 USB1.2 11.57,63.52 USB1.A12
  vias: v1(1.68,57.16) v1(1.68,56.32) v1(1.68,55.48) v1(1.68,54.64) v1(1.68,53.8) v1(1.68,52.96) v1(1.68,52.12) v1(1.68,51.28) v1(2.76,57.16) v1(2.76,56.32) v1(2.76,55.48) v1(2.76,54.64) v1(2.76,53.8) v1(2.76,52.96) v1(2.76,52.12) v1(2.76,51.28) v1(8.58,68.56) v1(8.58,67.72) v1(8.58,66.88) v1(8.58,63.16) v1(8.58,62.32) v1(8.58,61.48) v1(8.88,58.96) v1(9.66,67.72) v1(9.66,66.88) v1(9.66,62.32) v1(9.66,61.48) v1(24,59.5) v1(24,57.46) v1(24.66,45.04) v1(24.66,44.2) v1(25.74,45.88) v1(25.74,45.04) v1(25.74,44.2) v1(28.02,67.6) v1(29.1,68.44) v1(29.1,67.6) v1(29.1,66.76) v1(32.1,42.4) v1(32.1,41.56) v1(32.64,63.7) v1(32.64,62.62) v1(32.88,18.88) v1(32.88,17.65) v1(32.88,16.41) v1(32.88,15.18) v1(32.88,13.94) v1(32.88,11.47) v1(32.88,10.12) v1(32.94,27.64) v1(32.94,26.8) v1(32.94,25.96) v1(33.18,42.4) v1(33.18,41.56) v1(33.18,40.36) v1(33.48,63.7) v1(33.48,62.62) v1(33.9,18.92) v1(34.02,27.64) v1(34.02,26.8) v1(34.32,63.7) v1(34.32,62.62) v1(34.31,10.12) v1(34.56,53.62) v1(35.16,22) v1(35.16,20.92) v1(35.16,19.84) v1(35.16,18.92) v1(35.4,63.7) v1(35.4,62.62) v1(35.4,53.62) v1(35.4,52.54) v1(35.74,10.12) v1(36.24,63.7) v1(36.24,62.62) v1(36.24,53.62) v1(36.24,52.54) v1(37.08,63.7) v1(37.08,62.62) v1(37.14,61.6) v1(37.14,60.76) v1(37.14,59.92) v1(38.22,61.6) v1(38.22,60.76) v1(38.59,10.12) v1(41.45,10.12) v1(42.42,58.72) v1(42.42,57.88) v1(42.88,10.12) v1(43.5,58.72) v1(43.5,57.88) v1(43.5,57.04) v1(43.56,20.2) v1(44.26,19.36) v1(45.72,19.36) v1(45.73,10.12) v1(47.16,19.36) v1(47.16,18.2) v1(47.16,17.05) v1(47.16,15.89) v1(47.16,14.74) v1(47.16,13.58) v1(47.16,12.43) v1(47.16,11.27) v1(47.16,10.12) v1(47.28,37.12) v1(54.96,21.7) v1(55.8,22.78) v1(55.8,21.7) v1(56.64,22.78) v1(67.14,60.76) v1(67.14,59.08) v1(67.5,44.68) v1(67.5,43.84) v1(67.5,43) v1(67.62,32.56) v1(67.62,31.72) v1(67.62,30.88) v1(67.86,13) v1(67.86,12.16) v1(67.86,11.32) v1(68.22,60.76) v1(68.22,59.92) v1(68.22,59.08) v1(68.58,44.68) v1(68.58,43.84) v1(68.58,43) v1(68.7,32.56) v1(68.7,31.72) v1(68.7,30.88) v1(68.94,13) v1(68.94,12.16) v1(68.94,11.32)
VCC+3.3V: length 326.1
  Top Layer w0.178: U3.36 40.3,31.73 40.28,31.76 40.28,32.96 39.84,33.4 39.36,33.4 39.23,33.53 39.23,34.39 C11.2
  Top Layer w0.203: 38.8,24.28 38.74,24.22 C9.2 ; U3.24 48.82,29.82 49.02,30.03 49.02,31.16 48.84,31.34 47.42,31.34 47.24,31.52 C10.1
  Top Layer w0.254: 53.83,25.68 58.11,25.68 ; 53.83,25.68 R6.2 ; 53.83,25.68 53.83,32.3 53.21,32.92 50.33,32.92 ; R9.1 17.65,19.96 18.29,19.33 18.69,19.33 ; R10.1 22.97,19.56 22.73,19.33 18.69,19.33 ; 18.69,19.33 18.67,19.31 18.67,8.35 ; 35.34,34.35 38.97,34.35 C11.2 ; 18.56,48.5 18.56,55.79 19.43,56.66 20.45,56.66 20.63,56.84 20.63,58.25 C5.2 U1.16 ; 18.56,48.5 15.84,48.5 15.51,48.17 15.51,47.66 ; 18.56,48.5 27.81,48.5 27.81,49.87 27.5,50.19 ; 50.33,32.92 50.33,37.02 50.42,37.11 H3.3 ; 50.33,32.92 47.31,32.92 C10.1 ; 18.67,8.35 64.71,8.35 65.91,9.55 65.91,11.79 R7.2 R8.2 65.93,27.31 65.28,27.96 58.67,27.96 58.18,27.47 R4.1 ; 18.67,8.35 U5.1 ; 15.51,47.66 15.27,47.9 9.02,47.9 8.71,48.21 8.71,54.33 8.89,54.51 U1.4 ; 15.51,47.66 R11.2 ; 46.73,46 46.64,46.08 U2.4
  Top Layer w0.381: 27.81,48.5 27.81,44.73 28.45,44.09 35.28,44.09 35.34,44.03 C9.2 35.34,23.3 35.05,23.01 32.38,23.01 32.12,22.74 32.12,21.95 C16.2 C17.2 ; C17.2 28.96,25.75 ; C17.2 26.74,21.93 26.16,21.36 R10.1 ; H2.1 42.67,64.03 40.13,61.49 U2.2 ; H5.1 55.64,67.97 56.02,67.59 56.02,55.79 55.75,55.52 48.01,55.52 46.74,54.25 46.74,46 46.73,46
  Top Layer w0.508: U2.2 U2.4 39.27,46.94 C4.1 32.44,47.14 29.84,47.14 29.49,47.5 29.49,49.81 29.1,50.19 27.5,50.19
VCC+5V: length 26.3
  Top Layer w0.381: 22.24,53.61 22.24,55.67 22.61,56.03 27.4,56.03 D1.3 27.69,53.68 27.5,53.49 32.26,53.49 32.64,53.87 32.64,55.45 37.59,55.45 C1.2 37.85,51.77 U2.3
VDDA+3.3V: length 35.1
  Top Layer w0.203: v1(48.9,21.61) 48.77,21.49 44.58,21.49 44.34,21.72 44.34,22.79
  Top Layer w0.254: 63.48,23.54 63.48,25.33 63.24,25.56 60.35,25.56 ; C12.2 64.7,23.72 64.9,23.52 64.9,19.33 64.64,19.07 v1(48.9,19.07)
  Bottom Layer w0.254: v1(48.9,19.07) v1(48.9,21.61)
A0: length 52.4
  Top Layer w0.203: U3.10 v1(44.8,23.9)
  Top Layer w0.254: U5.2 21.21,3.58 20.96,3.32 13.72,3.32 LED4.2
  Bottom Layer w0.203: U5.2 21.08,5.36 21.08,23.01 21.97,23.9 v1(44.8,23.9)
A2: length 46.9
  Top Layer w0.203: v1(17.02,37.11) 17.02,40.78 U4.15
  Top Layer w0.254: 45.8,22.78 45.95,22.63 v1(46.48,22.63)
  Bottom Layer w0.203: v1(17.02,37.11) 42.54,37.11 43.67,35.98 43.67,25.95 43.81,25.8 45.09,25.8 46.48,24.41 v1(46.48,22.63)
A3: length 48.4
  Top Layer w0.203: U4.16 14.73,40.62 v1(14.73,37.87) ; U3.13 46.62,24.32 46,24.94 46,26.67 v1(45.97,26.69)
  Bottom Layer w0.203: v1(45.97,26.69) 44.45,26.69 44.31,26.84 44.31,37 43.43,37.87 14.86,37.87 14.72,38.01 14.72,37.89 v1(14.73,37.87)
A4: length 23.3
  Top Layer w0.203: v1(54.61,11.96) 54.69,11.89 LED2.1 ; 47.3,24.78 48.14,24.78 49.02,23.9 v1(49.53,23.9)
  Bottom Layer w0.203: v1(49.53,23.9) 49.53,13.23 50.8,11.96 v1(54.61,11.96)
A5: length 21.5
  Top Layer w0.203: 58.74,14.79 58.69,14.84 v1(55.89,14.84) ; 47.3,25.28 47.33,25.3 v1(49.65,25.3)
  Bottom Layer w0.203: v1(49.65,25.3) 49.77,25.42 50.6,25.42 50.8,25.22 50.8,15.64 51.61,14.84 v1(55.89,14.84)
A8: length 17.7
  Top Layer w0.203: 43.75,31.9 43.75,29.66 43.75,29.65 v1(45.01,29.65) ; v1(45.39,40.26) 45.48,40.35 48.8,40.35
  Bottom Layer w0.203: v1(45.39,40.26) 45.01,39.88 v1(45.01,29.65)
A9: length 63
  Top Layer w0.203: U1.3 8.02,55.78 v1(7.87,55.92) ; U3.30 v1(43.3,44.73)
  Bottom Layer w0.203: v1(43.3,44.73) 43.3,55.4 42.78,55.92 v1(7.87,55.92)
A10: length 64.9
  Top Layer w0.203: U3.31 42.8,43.33 v1(42.04,44.09) ; v1(6.73,55.01) 6.73,56.66 7.11,57.05 U1.2
  Bottom Layer w0.203: v1(6.73,55.01) 41.02,55.01 42.04,54 v1(42.04,44.09)
B0: length 19.2
  Top Layer w0.203: v1(52.83,28.41) 52.83,27.2 52.42,26.79 47.89,26.79
  Bottom Layer w0.203: 62.53,32.07 53.63,32.07 52.83,31.27 v1(52.83,28.41)
B1: length 21.1
  Top Layer w0.203: v1(51.59,28.8) 51.59,27.87 51.05,27.33 47.9,27.33
  Bottom Layer w0.203: 62.55,34.62 62.5,34.57 52.47,34.57 51.59,33.69 v1(51.59,28.8)
B10: length 50.4
  Top Layer w0.203: v1(50.38,28.43) 50.27,28.32 U3.21
  Bottom Layer w0.203: v1(50.38,28.43) 50.38,49.77 51.56,50.95 57.02,50.95 57.67,51.6 57.67,64.78 57.02,65.43 H5.2
B11: length 44.1
  Top Layer w0.203: v1(44.96,28.72) 45.06,28.82 U3.22
  Bottom Layer w0.203: v1(44.96,28.72) 45.09,28.85 49.45,28.85 49.66,29.05 49.66,62 50.55,62.89 H5.3
CC1: length 11.3
  Top Layer w0.203: R1.1 23.77,67.97 v1(21.73,67.97) ; v1(16.51,65.55) 16.51,63.54 USB1.A5
  Bottom Layer w0.203: v1(16.51,65.55) 17.4,66.44 21.59,66.44 21.73,66.59 v1(21.73,67.97)
CC2: length 14
  Top Layer w0.203: R2.1 23.89,62.14 v1(23.91,62.13) ; USB1.B5 v1(13.49,62)
  Bottom Layer w0.203: v1(13.49,62) 23.78,62 v1(23.91,62.13)
DN: length 18.2
  Top Layer w0.178: 14.99,61.43 15.06,61.36 15.75,61.36 15.99,61.61 USB1.B7 ; 14.99,61.43 14.99,52.48 14.48,51.97 U1.6 ; 14.99,61.43 14.99,62.47 15.03,62.5 15.03,63.03 14.99,63.07 USB1.A7
DP: length 18.3
  Top Layer w0.178: U1.5 13.97,53.24 14.49,53.76 USB1.B6 14.49,65.44 14.6,65.55 15.37,65.55 15.49,65.43 15.49,63.52 USB1.A6
HSI-IN: length 10.4
  Top Layer w0.152: C8.2 40.39,16.8 X3.2 42.04,16.91 42.3,17.18
  Top Layer w0.203: 42.3,22.78 42.3,17.18
HSI-OUT: length 10.6
  Top Layer w0.152: C7.1 44.59,13.95 X3.1 43.06,16.91 42.8,17.17
  Top Layer w0.203: U3.6 42.8,17.17
LSI-IN: length 16.5
  Top Layer w0.203: 41.3,22.78 41.3,24 41.28,24.03 40.26,24.03 39.24,23.01 36.96,23.01 36.32,22.38 36.32,17.17 36.13,16.97 X2.2 35,16.91 C15.2
LSI-OUT: length 16.5
  Top Layer w0.203: C14.1 37.62,13.88 X2.1 37.47,17.13 37.47,19.58 37.72,19.83 38.47,19.83 38.74,20.1 38.74,20.63 38.53,20.83 37.35,20.83 37.21,20.98 37.21,21.74 37.34,21.87 38.99,21.87 39.51,21.34 41.64,21.34 41.8,21.51 41.8,22.78
RST: length 13.6
  Top Layer w0.203: 51.81,22.39 51.8,22.38 47.74,22.38 45.47,24.66 43.69,24.66 43.3,24.28 43.3,23.44
  Top Layer w0.254: C13.2 51.88,25.5 R6.1
SWCLK: length 45.5
  Top Layer w0.178: v1(42.24,34.48) 42.24,40.48 v1(42.12,40.6) ; v1(42.36,29.08) 41.62,29.82 U3.37
  Bottom Layer w0.178: H2.2 44.89,67.64 44.89,42.41 44.76,42.28 42.48,42.28 42.12,41.92 v1(42.12,40.6) ; v1(42.24,34.48) 42.36,34.36 v1(42.36,29.08)
SWDIO: length 43.4
  Top Layer w0.178: H2.3 47.77,67.95 47.77,65.21 47.64,65.08 44.16,65.08 v1(43.8,64.72) ; U3.34 v1(41.3,42.88)
  Bottom Layer w0.178: v1(41.3,42.88) 44.16,42.88 44.28,43 44.28,64.24 v1(43.8,64.72)
$1N3764: length 3.3
  Top Layer w0.254: LED1.1 20.64,50.39 R3.2
$3N420: length 3.9
  Top Layer w0.254: R7.1 64.33,11.89 LED2.2
$3N525: length 3.9
  Top Layer w0.254: LED3.2 64.33,14.85 R8.1
$3N833: length 4.8
  Top Layer w0.254: R9.2 15.65,22.6 14.96,23.29 U4.1
$3N837: length 6
  Top Layer w0.254: R10.2 20.84,21.49 19.43,21.49 18.96,21.96 U4.3
$3N1055: length 9.9
  Top Layer w0.254: U4.12 22.91,40.89 22.91,43.4 22.73,43.58 17.78,43.58 17.51,43.85 R11.1
$3N1059: length 14.7
  Top Layer w0.254: R12.1 20.59,47.41 20.83,47.65 26.42,47.65 26.96,47.11 U4.10
$3N1324: length 2.3
  Top Layer w0.254: LED4.1 13.58,7.4 R13.2
$3N1566: length 2.8
  Top Layer w0.381: U6.3 R14.2
$3N1643: length 2.5
  Top Layer w0.381: Q1.1 49.02,45.04 R15.1
$3N3384: length 21.2
  Top Layer w0.381: Q1.2 60.26,46.95 61.09,47.77 63.75,47.77 H4.1 U6.1 U6.2

## Copper pours and planes (outline as drawn; the poured copper is in the pictures)
+5V on Top Layer: 17.4,64.03 27.31,64.03 27.31,57.93 17.4,57.93
GND on Top Layer: -10.2,77.92 85.08,77.92 85.08,-8.96 -10.2,-8.96
GND on Bottom Layer: -14.16,79 83.88,79 83.88,-10.64 -14.16,-10.64
$1N4521 on Top Layer: 28.14,68.35 35.31,68.35 35.31,58.06 28.14,58.06

Small or netless copper shapes (teardrops, artwork), in the pictures only: 224 on Top Layer, 36 on Bottom Layer

## Text on the board
Bottom Silkscreen Layer: LILINNG
